# EAGLE design MRCS-CMRI-32-Line-stall-motor-adapter (EAGLE 7.7.0)
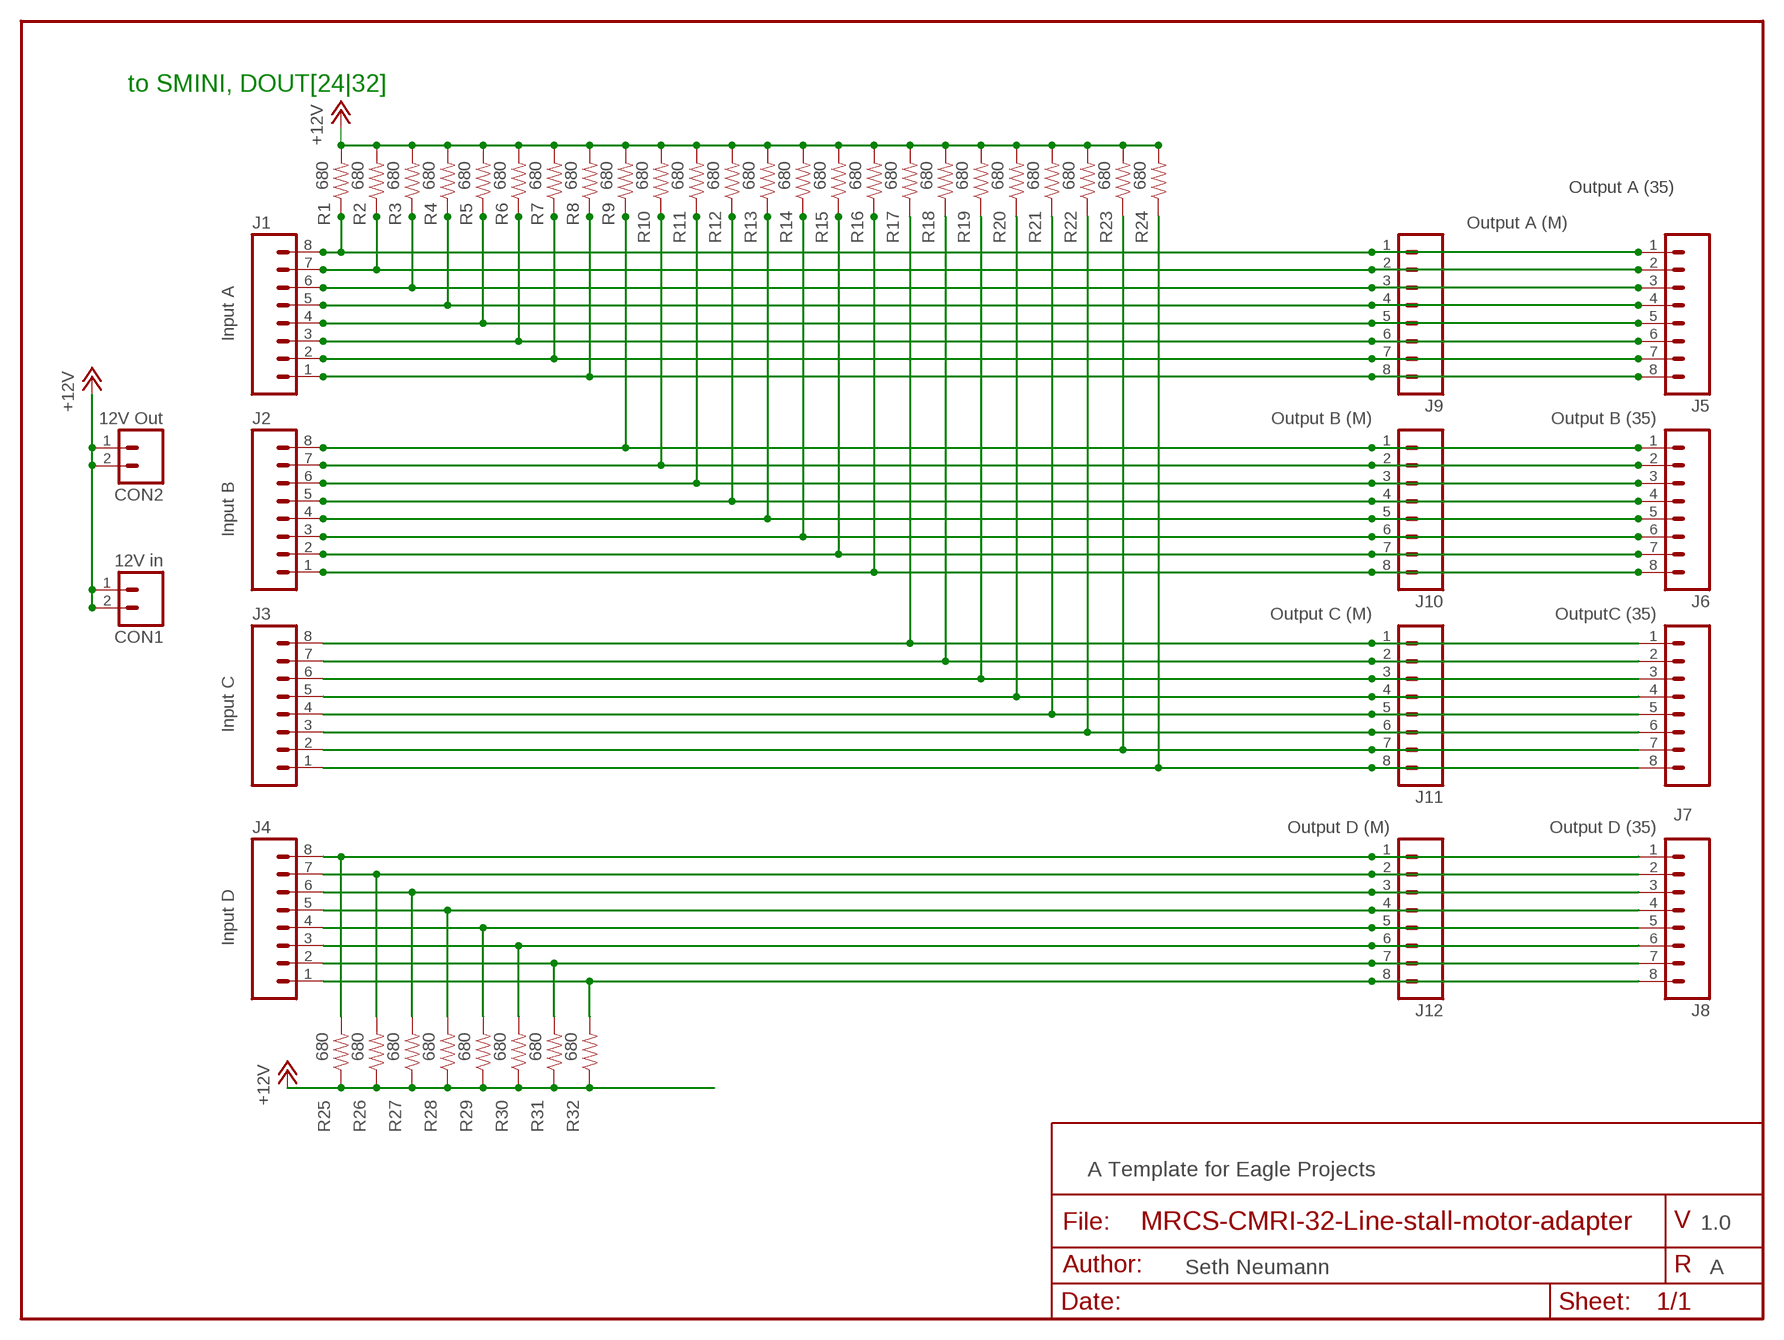
[diagram p0: schematic, sheet 1]

## Parts
CON1  12V in  CONNECTOR-M025MM-LOCK  [SCREWTERMINAL-5MM-2]
CON2  12V Out  CONNECTOR-M025MM-LOCK  [SCREWTERMINAL-5MM-2]
J1  Input A  CONNECTOR-M081.56-F  [KK-156-8-F]
J2  Input B  CONNECTOR-M081.56-F  [KK-156-8-F]
J3  Input C  CONNECTOR-M081.56-F  [KK-156-8-F]
J4  Input D  CONNECTOR-M081.56-F  [KK-156-8-F]
J5  Output A (35)  CONNECTOR-M083.5MM-8  [SCREWTERMINAL-3.5MM-8]
J6  Output B (35)  CONNECTOR-M083.5MM-8  [SCREWTERMINAL-3.5MM-8]
J7  OutputC (35)  CONNECTOR-M083.5MM-8  [SCREWTERMINAL-3.5MM-8]
J8  Output D (35)  CONNECTOR-M083.5MM-8  [SCREWTERMINAL-3.5MM-8]
J9  Output A (M)  CONNECTOR-M081.56-F  [KK-156-8-F]
J10  Output B (M)  CONNECTOR-M081.56-F  [KK-156-8-F]
J11  Output C (M)  CONNECTOR-M081.56-F  [KK-156-8-F]
J12  Output D (M)  CONNECTOR-M081.56-F  [KK-156-8-F]
R1  680  RESISTORPTH-1/2W  [AXIAL-0.5]
R2  680  RESISTORPTH-1/2W  [AXIAL-0.5]
R3  680  RESISTORPTH-1/2W  [AXIAL-0.5]
R4  680  RESISTORPTH-1/2W  [AXIAL-0.5]
R5  680  RESISTORPTH-1/2W  [AXIAL-0.5]
R6  680  RESISTORPTH-1/2W  [AXIAL-0.5]
R7  680  RESISTORPTH-1/2W  [AXIAL-0.5]
R8  680  RESISTORPTH-1/2W  [AXIAL-0.5]
R9  680  RESISTORPTH-1/2W  [AXIAL-0.5]
R10  680  RESISTORPTH-1/2W  [AXIAL-0.5]
R11  680  RESISTORPTH-1/2W  [AXIAL-0.5]
R12  680  RESISTORPTH-1/2W  [AXIAL-0.5]
R13  680  RESISTORPTH-1/2W  [AXIAL-0.5]
R14  680  RESISTORPTH-1/2W  [AXIAL-0.5]
R15  680  RESISTORPTH-1/2W  [AXIAL-0.5]
R16  680  RESISTORPTH-1/2W  [AXIAL-0.5]
R17  680  RESISTORPTH-1/2W  [AXIAL-0.5]
R18  680  RESISTORPTH-1/2W  [AXIAL-0.5]
R19  680  RESISTORPTH-1/2W  [AXIAL-0.5]
R20  680  RESISTORPTH-1/2W  [AXIAL-0.5]
R21  680  RESISTORPTH-1/2W  [AXIAL-0.5]
R22  680  RESISTORPTH-1/2W  [AXIAL-0.5]
R23  680  RESISTORPTH-1/2W  [AXIAL-0.5]
R24  680  RESISTORPTH-1/2W  [AXIAL-0.5]
R25  680  RESISTORPTH-1/2W  [AXIAL-0.5]
R26  680  RESISTORPTH-1/2W  [AXIAL-0.5]
R27  680  RESISTORPTH-1/2W  [AXIAL-0.5]
R28  680  RESISTORPTH-1/2W  [AXIAL-0.5]
R29  680  RESISTORPTH-1/2W  [AXIAL-0.5]
R30  680  RESISTORPTH-1/2W  [AXIAL-0.5]
R31  680  RESISTORPTH-1/2W  [AXIAL-0.5]
R32  680  RESISTORPTH-1/2W  [AXIAL-0.5]

## Nets
+12V: CON1.1(A) CON1.2(B) CON2.1(A) CON2.2(B) R1.P$2 R2.P$2 R3.P$2 R4.P$2 R5.P$2 R6.P$2 R7.P$2 R8.P$2 R9.P$2 R10.P$2 R11.P$2 R12.P$2 R13.P$2 R14.P$2 R15.P$2 R16.P$2 R17.P$2 R18.P$2 R19.P$2 R20.P$2 R21.P$2 R22.P$2 R23.P$2 R24.P$2 R25.P$1 R26.P$1 R27.P$1 R28.P$1 R29.P$1 R30.P$1 R31.P$1 R32.P$1
N$1: J1.5 J5.4 J9.4 R4.P$1
N$2: J1.8 J5.1 J9.1 R1.P$1
N$3: J2.8 J6.1 J10.1 R9.P$1
N$4: J1.7 J5.2 J9.2 R2.P$1
N$5: J2.6 J6.3 J10.3 R11.P$1
N$6: J3.8 J7.1 J11.1 R17.P$1
N$7: J2.4 J6.5 J10.5 R13.P$1
N$8: J2.3 J6.6 J10.6 R14.P$1
N$9: J1.4 J5.5 J9.5 R5.P$1
N$10: J1.3 J5.6 J9.6 R6.P$1
N$11: J1.2 J5.7 J9.7 R7.P$1
N$12: J1.1 J5.8 J9.8 R8.P$1
N$13: J1.6 J5.3 J9.3 R3.P$1
N$14: J2.7 J6.2 J10.2 R10.P$1
N$15: J2.2 J6.7 J10.7 R15.P$1
N$16: J2.1 J6.8 J10.8 R16.P$1
N$17: J2.5 J6.4 J10.4 R12.P$1
N$18: J3.7 J7.2 J11.2 R18.P$1
N$19: J3.6 J7.3 J11.3 R19.P$1
N$20: J3.5 J7.4 J11.4 R20.P$1
N$21: J3.4 J7.5 J11.5 R21.P$1
N$22: J3.3 J7.6 J11.6 R22.P$1
N$23: J3.2 J7.7 J11.7 R23.P$1
N$24: J3.1 J7.8 J11.8 R24.P$1
N$25: J4.8 J8.1 J12.1 R25.P$2
N$26: J4.7 J8.2 J12.2 R26.P$2
N$27: J4.6 J8.3 J12.3 R27.P$2
N$28: J4.5 J8.4 J12.4 R28.P$2
N$29: J4.4 J8.5 J12.5 R29.P$2
N$30: J4.3 J8.6 J12.6 R30.P$2
N$31: J4.2 J8.7 J12.7 R31.P$2
N$32: J4.1 J8.8 J12.8 R32.P$2

## Notes on the sheet
- to SMINI, DOUT[24|32]
- A Template for Eagle Projects
- 1.0
- Seth Neumann | A

## Library data of the parts
CON1 CON2 = SPCoast:CONNECTOR-M02: PHOENIX CONNECTOR
J1-J12 = SPCoast:CONNECTOR-M08: Header 8 Standard 8-pin 0.1" header. Use with straight break away headers (SKU : PRT-00116), right angle break away headers (PRT-00553), swiss pins (PRT-00743), machine pins (PRT-00117), and female headers (PRT-00115).
R1-R32 = SparkFun-Passives:RESISTOR: Resistor Basic schematic elements and footprints for 0603, 1206, and PTH resistors.

## Board
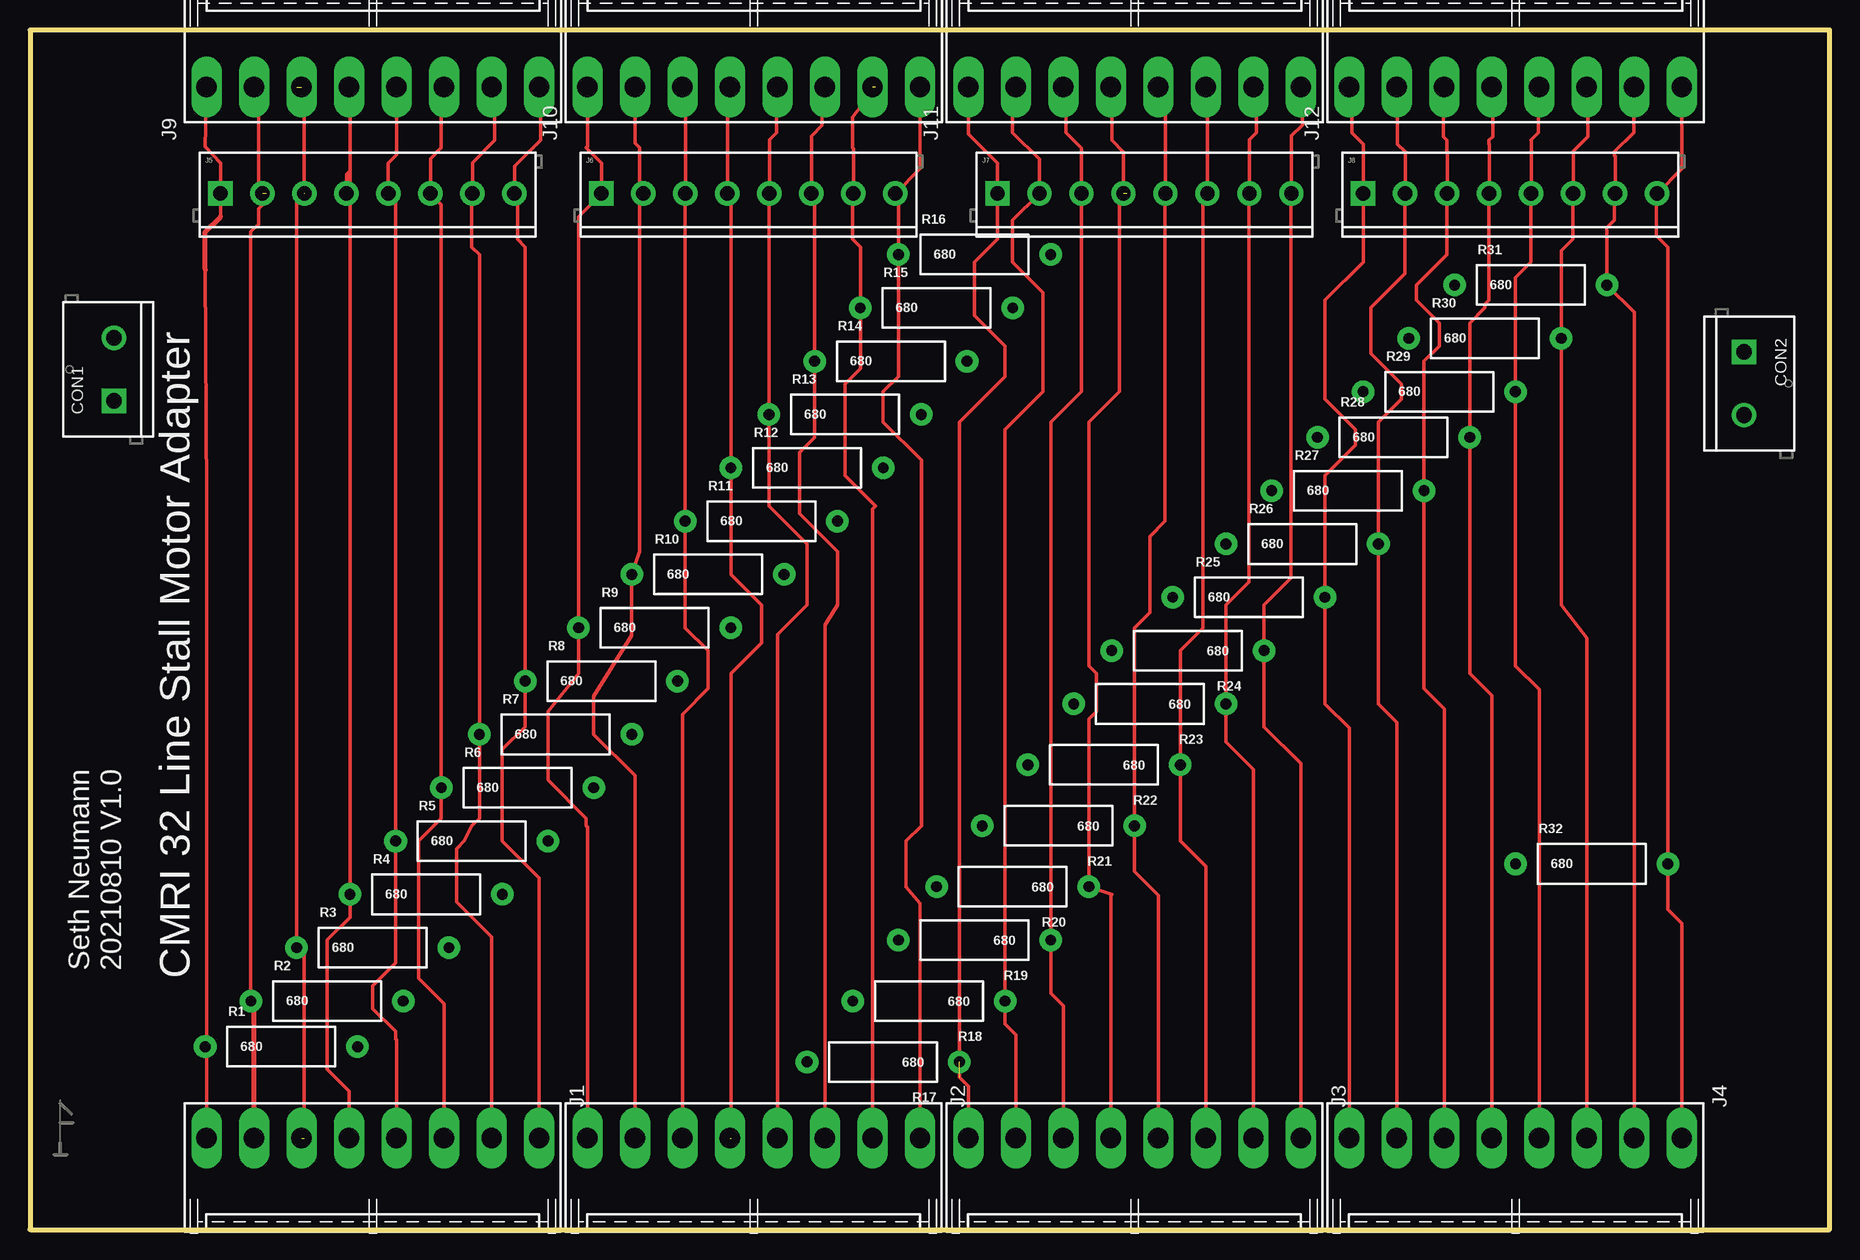
[diagram p1: board, top side]
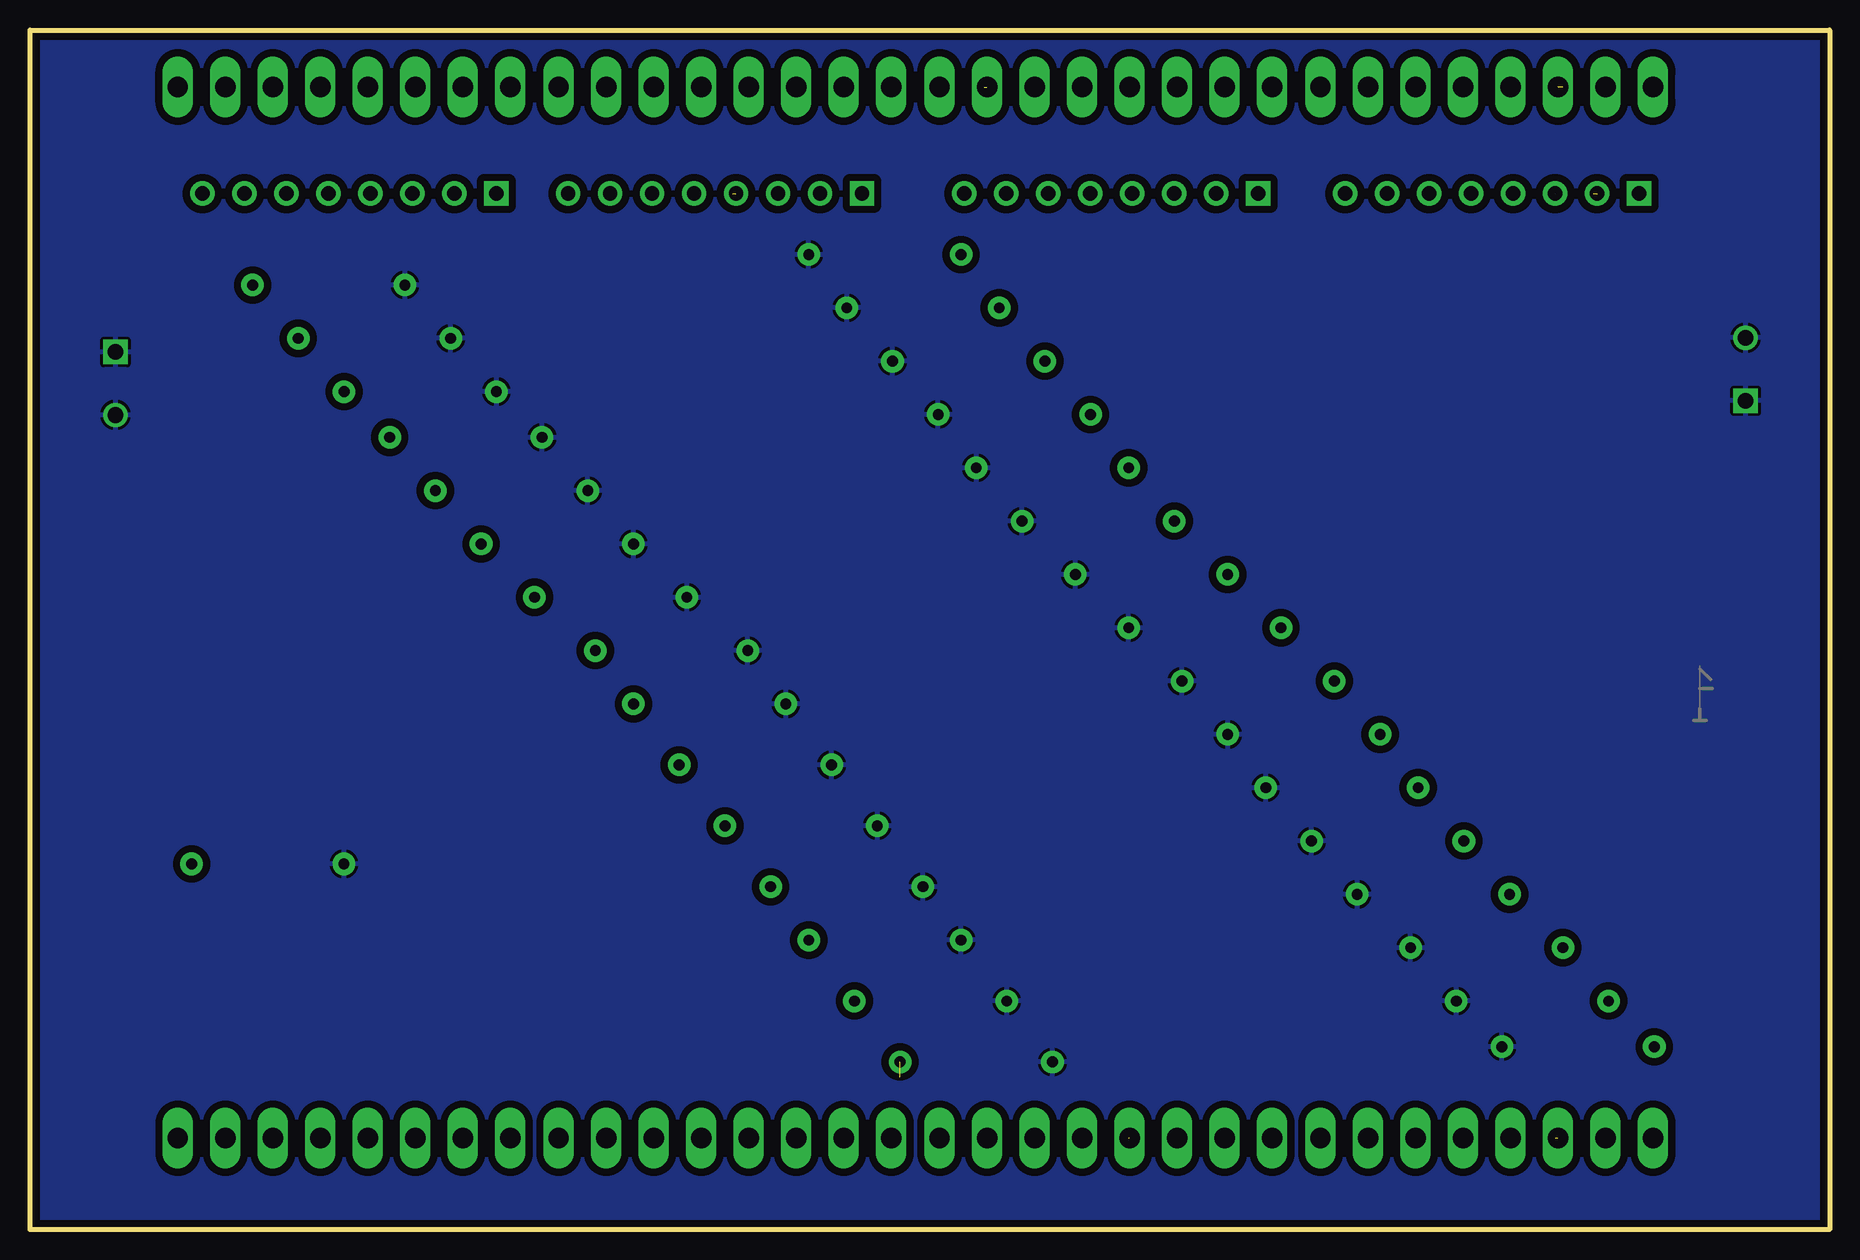
[diagram p2: board, bottom side, seen from below]

Size 150 x 100 mm. Coordinates in mm from the lower left corner, seen from the top.
Outline: 0,0 150,0 150,100 0,100 0,0
Copper layers (1*16): Top 0.035mm / dielectric 1.5mm / Bottom 0.035mm
Design rules "default *": minimum track width 5mil, minimum drill 0.2mm, track to track 5mil, track to pad 5mil, pad to pad 5mil, via to via 5mil, smd to smd 5mil, copper to edge 0.4mm, drill to drill 5mil, minimum pad ring 3mil, minimum via ring 3mil, stop-mask expansion 4mil, vias tented up to drill 0mil, thermal gap 10mil

### Footprints (pad centres in the part's own frame; a part is rotated, then mirrored left to right if it is on the bottom)
SCREWTERMINAL-5MM-2 = drill 1.3 pad 2.032 square: 1 -0.127,0 | drill 1.3 pad 2.032: 2 5.127,0
KK-156-8-F = drill 1.7 pad 2.184 long: 1 -13.86,0; 2 -9.9,0; 3 -5.94,0; 4 -1.98,0; 5 1.98,0; 6 5.94,0; 7 9.9,0; 8 13.86,0
SCREWTERMINAL-3.5MM-8 = drill 1.2 pad 2.032 square: 1 0,0 | drill 1.2 pad 2.032: 2 3.5,0; 3 7,0; 4 10.5,0; 5 14,0; 6 17.5,0; 7 21,0; 8 24.5,0
AXIAL-0.5 = drill 0.9 pad 1.88: P$1 -6.35,0; P$2 6.35,0

### Placement (x,y rotation side)
CON1  6.99,69.22 90 top
CON2  142.88,73.03 270 top
J1  28.57,7.62 180 top
J2  60.33,7.62 180 top
J3  92.08,7.62 180 top
J4  123.83,7.62 180 top
J5  15.88,86.36 0 top
J6  47.62,86.36 0 top
J7  80.64,86.36 0 top
J8  111.12,86.36 0 top
J9  28.57,95.25 0 top
J10  60.33,95.25 0 top
J11  92.08,95.25 0 top
J12  123.83,95.25 0 top
R1  20.95,15.24 0 top
R2  24.77,19.05 0 top
R3  28.57,23.5 0 top
R4  33.02,27.94 0 top
R5  36.83,32.38 0 top
R6  40.64,36.83 0 top
R7  43.81,41.27 0 top
R8  47.62,45.72 0 top
R9  52.07,50.16 0 top
R10  56.52,54.61 0 top
R11  60.96,59.05 0 top
R12  64.77,63.5 0 top
R13  67.94,67.94 0 top
R14  71.75,72.39 0 top
R15  75.56,76.83 0 top
R16  78.74,81.28 0 top
R17  71.12,13.97 180 top
R18  74.93,19.05 180 top
R19  78.74,24.13 180 top
R20  81.92,28.57 180 top
R21  85.72,33.66 180 top
R22  89.53,38.73 180 top
R23  93.34,43.81 180 top
R24  96.52,48.26 180 top
R25  101.6,52.7 0 top
R26  106.05,57.15 0 top
R27  109.86,61.59 0 top
R28  113.67,66.04 0 top
R29  117.47,69.85 0 top
R30  121.28,74.3 0 top
R31  125.09,78.74 0 top
R32  130.18,30.48 0 top
U$1  [MRCSLOGOTOP]  1.27,5.71 0 top
U$2  [MRCSLOGOBTM]  4.45,41.91 0 top
U$3  [CA-PROP65WARNING]  26.04,60.96 0 top

### Tracks (layer width: path | path; a pad name or v marks a point on that pad's centre or on a via)
+12V
  Top 0.406: R1.P$2 27.94,15.24
  pour Bottom (isolate 0.61): 0,0 148.59,0 149.86,1.27 149.86,100.33 0,100.33
N$1
  Top 0.305: J1.5 26.59,11.51 24.77,13.34 24.77,24.13 26.67,26.04 R4.P$1 26.67,88.27 | 26.67,88.27 26.67,95.33 | 26.67,95.89 26.67,95.33 | 26.67,95.33 J9.4 | J5.4 26.38,87.97 26.67,88.27
N$2
  Top 0.305: 14.61,80.01 14.71,61.07 J1.8 14.71,15.13 R1.P$1 | J9.1 14.61,90.28 15.88,88.9 J5.1 15.88,84.45
  Top 0.406: 14.61,80.01 14.61,83.19 15.88,84.45
N$3
  Top 0.305: J2.8 46.47,33.55 46.35,33.66 46.35,34.29 43.18,37.47 43.18,43.18 45.72,46.35 R9.P$1 45.72,84.45 J6.1 47.62,88.9 46.35,90.17 46.47,90.28 J10.1
N$4  (1 unrouted)
  Top 0.305: R2.P$1 18.41,83.19 19.05,83.82 19.05,85.09 19.68,85.72 19.68,86.36 19.05,87 19.05,94.88 J9.2
  Top 0.406: J1.7 18.68,18.79 R2.P$1
N$5
  Top 0.305: J2.6 54.38,42.95 56.52,45.09 56.52,48.26 54.61,50.16 R11.P$1 54.61,86.34 J6.3 54.62,95.01 J10.3
N$6  (1 unrouted)
  Top 0.305: J3.8 78.22,11.96 77.47,12.7 77.47,67.31 81.28,71.12 81.28,73.66 78.74,76.2 78.74,80.64 80.64,82.55 J7.1 80.64,88.9 78.22,91.33 J11.1
N$7
  Top 0.305: J2.4 62.3,49.6 64.77,52.07 64.77,57.15 61.59,60.33 R13.P$1 61.59,86.33 J6.5 61.62,90.83 62.23,91.44 62.23,95.17 J10.5
N$8
  Top 0.305: J2.3 66.27,50.39 67.31,52.07 67.31,56.52 64.14,59.69 64.14,64.77 65.41,66.04 R14.P$1 65.41,86.08 J6.6 65.12,91.16 66.04,92.08 66.04,95.03 J10.6
N$9
  Top 0.305: J9.5 30.55,89.61 29.84,88.9 29.84,86.39 J5.5 30.48,85.75 R5.P$1 30.48,22.23 28.57,20.32 28.57,18.41 30.48,16.51 30.48,15.88 30.55,15.8 J1.4
N$10
  Top 0.305: J1.3 34.52,18.82 32.38,20.95 32.38,32.38 34.29,34.29 R6.P$1 34.29,85.44 J5.6 33.38,89.25 34.29,90.17 34.29,95.03 J9.6
N$11
  Top 0.305: J1.2 38.48,24.39 35.56,27.3 35.56,31.75 36.2,32.38 36.83,33.66 37.47,34.29 R7.P$1 37.47,81.28 36.83,81.92 36.83,86.31 J5.7 36.88,88.94 38.73,90.81 38.73,94.99 J9.7
N$12
  Top 0.305: J1.1 42.44,29.32 39.37,32.38 39.37,40.01 41.27,41.91 R8.P$1 41.27,81.92 40.64,82.55 40.64,86.09 J5.8 40.38,88.64 42.55,90.81 42.55,95.14 J9.8
N$13  (3 unrouted)
  Top 0.305: 22.86,7.62 22.86,23.5 R3.P$1 22.23,85.72 22.86,86.36 22.86,94.61 22.23,95.25 | J5.3 22.88,87.01
N$14
  Top 0.305: J2.7 50.42,37.84 46.99,41.27 46.99,44.45 50.16,49.53 R10.P$1 50.8,56.52 50.8,86.03 J6.2 50.8,86.69 50.8,90.17 50.42,90.55 J10.2
N$15  (1 unrouted)
  Top 0.305: J2.2 70.22,60.06 70.48,60.33 67.94,62.87 67.94,70.48 69.22,71.75 R15.P$1 69.22,81.92 68.58,82.55 68.58,86.31 J6.7 68.62,90.12 68.58,90.17 68.58,92.71 70.48,95.25
N$16
  Top 0.305: J10.8 74.19,88.42 J6.8 72.39,86.09 R16.P$1 72.39,71.12 71.12,69.85 71.12,67.31 74.3,64.14 74.3,33.66 73.03,32.38 73.03,28.57 74.19,27.2 J2.1
N$17  (1 unrouted)
  Top 0.305: 58.42,7.62 58.42,46.35 60.96,48.9 60.96,52.07 58.42,54.61 R12.P$1 58.42,86.06 J6.4 58.12,94.32 58.42,94.61 58.42,95.17 J10.4
N$18
  Top 0.305: J3.7 82.17,16.25 81.28,17.14 R18.P$1 81.28,66.67 84.45,69.85 84.45,78.11 81.92,80.64 81.92,84.13 J7.2 84.14,89.21 81.92,91.44 81.92,94.99 J11.2
N$19
  Top 0.305: J3.6 86.14,18.64 85.09,19.68 R19.P$1 85.09,67.31 87.63,69.85 87.63,86.34 J7.3 87.64,90.16 86.36,91.44 86.36,95.03 J11.3
N$20  (1 unrouted)
  Top 0.305: J3.5 90.09,27.86 90.17,27.94 R20.P$1 88.27,42.55 88.9,43.18 88.9,46.35 88.27,46.99 88.27,67.31 90.81,69.85 90.81,85.72 91.44,86.36 | J7.4 91.14,89.83 90.17,90.81 90.17,95.17 J11.4
N$21
  Top 0.305: J3.4 94.06,27.86 92.08,29.84 R21.P$1 92.08,50.16 93.34,51.44 93.34,57.78 94.61,59.05 94.61,86.33 J7.5 94.64,94.66 J11.5
N$22
  Top 0.305: J3.3 98.02,30.25 95.89,32.38 R22.P$1 95.89,48.26 97.79,50.16 97.79,86 J7.6 98.14,95.12 J11.6
N$23
  Top 0.305: J3.2 101.97,38.36 99.69,40.64 R23.P$1 99.69,52.07 101.6,53.98 101.6,86.31 J7.7 101.64,90.85 102.23,91.44 102.23,94.99 J11.7
N$24
  Top 0.305: J3.1 105.94,38.84 102.87,41.91 R24.P$1 102.87,52.07 105.09,54.29 105.09,86.31 J7.8 105.14,91.17 106.05,92.08 106.05,95.14 J11.8
N$25
  Top 0.305: J4.8 109.97,41.8 107.95,43.81 R25.P$2 107.95,62.87 110.49,65.41 110.49,66.67 107.95,69.22 107.95,77.47 111.12,80.64 J8.1 111.12,90.49 110.17,91.44 110.17,95.04 J12.1
N$26
  Top 0.305: J4.7 113.92,42.28 112.39,43.81 R26.P$2 112.39,67.31 114.3,69.22 114.3,70.48 111.76,73.03 111.76,76.83 114.62,79.69 J8.2 114.62,89.84 113.98,90.49 113.98,95.19 J12.2
N$27
  Top 0.305: J4.6 117.89,43.41 116.2,45.09 R27.P$2 116.2,72.39 117.47,73.66 117.47,75.56 115.57,77.47 115.57,78.74 118.11,81.28 118.11,86.34 J8.3 118.12,89.84 118.11,89.85 118.11,90.81 117.79,91.12 117.79,95.16 J12.3
N$28
  Top 0.305: J4.5 121.84,44.52 120.02,46.35 R28.P$2 120.02,75.56 121.28,76.83 121.28,77.15 121.6,77.47 121.6,86.34 J8.4 121.62,90.47 121.6,90.49 121.6,90.81 121.92,91.12 121.92,95.17 J12.4
N$29
  Top 0.305: J4.4 125.81,45.01 123.83,46.99 R29.P$2 123.83,79.38 125.09,80.64 125.09,86.33 J8.5 125.12,90.78 125.09,90.81 125.73,91.44 125.73,95.17 J12.5
N$30
  Top 0.305: J4.3 129.76,49.3 127.64,52.07 R30.P$2 127.64,81.6 128.59,82.55 128.59,86.32 J8.6 128.62,89.89 129.86,91.12 129.86,95.16 J12.6
N$31
  Top 0.305: J4.2 133.72,76.46 R31.P$2 131.44,83.5 132.08,84.14 132.08,86.31 J8.7 132.12,89.49 132.08,89.53 132.08,89.85 133.67,91.44 133.67,95.19 J12.7
N$32
  Top 0.305: J12.8 137.69,88.42 J8.8 135.57,86.31 135.57,82.87 136.53,81.92 R32.P$2 136.53,26.67 137.69,25.51 J4.1

### Text on the board
tPlace: Seth Neumann / 20210810 V1.0 | CMRI 32 Line Stall Motor Adapter
Document: Use tPlace/bPlace for silkscreen text and drawings / Use Document, tDocu and bDocu for assembly notes and documentation that does NOT go on the board